# Altium schematic sheet 5V-REG.SchDoc
size A; SheetNumber: 1; SheetTotal: 1
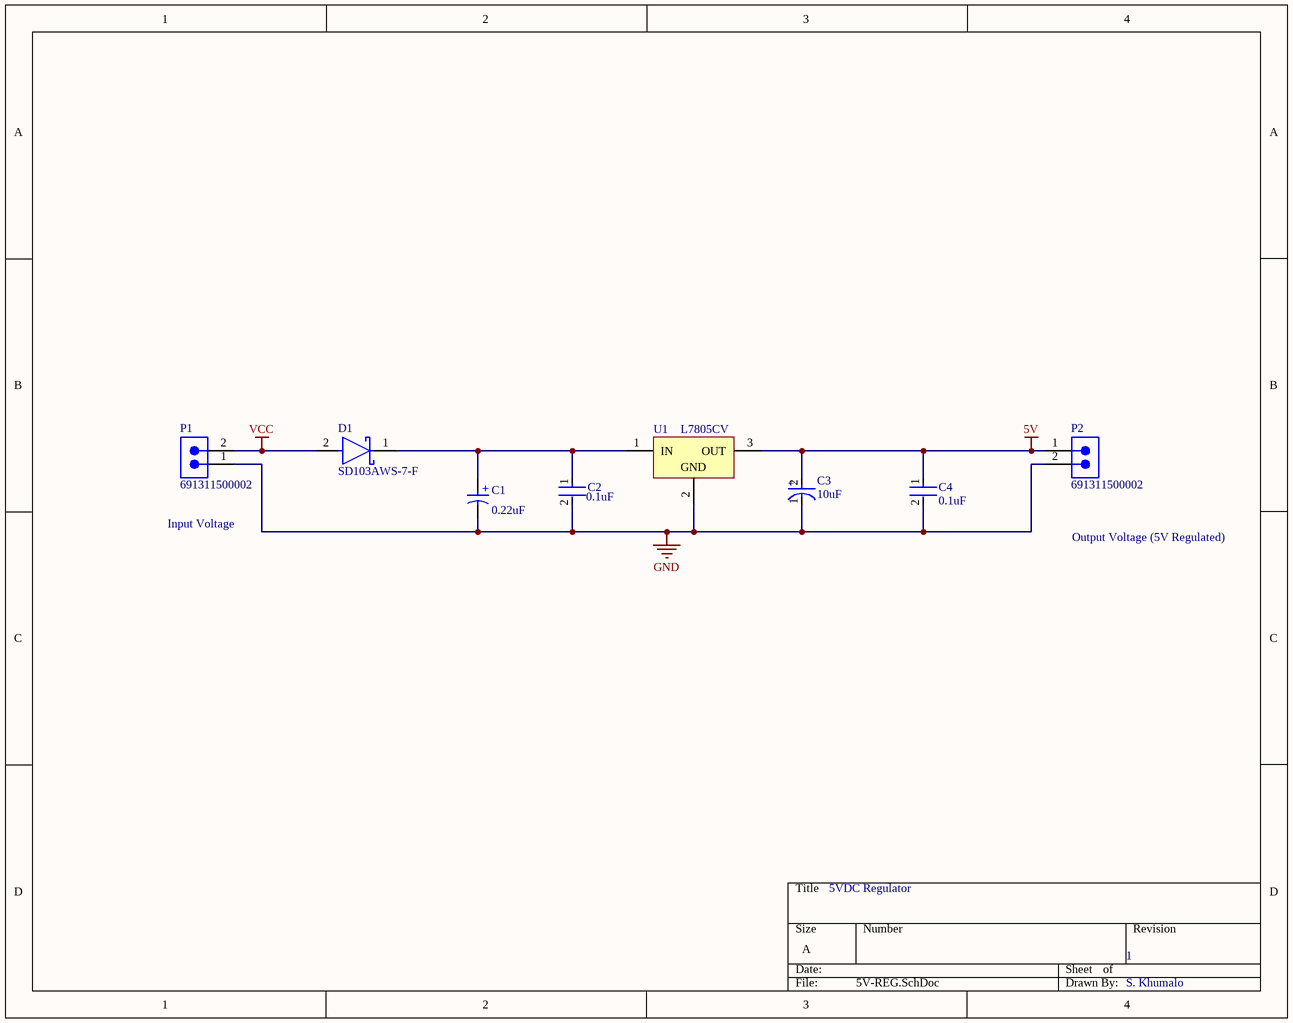
[diagram p0: 5V-REG.SchDoc]

## Parts
C1  0.22uF  [WCAP-ATG8_D5H11]
C2  0.1uF  [FP-RDE0P1-MFG]
C3  10uF  [FP-RAD-TH-D_5_0_5-L_11_1-MFG]
C4  0.1uF  [FP-RDE0P1-MFG]
D1  SD103AWS-7-F  [FP-SOD323-MFG]
P1  691311500002  [691311500002]
P2  691311500002  [691311500002]
U1  L7805CV  [TO220]

## Nets
5V: C3.2(A) C4.1 P2.1 U1.3(OUT)
GND: C1.2(N) C2.2 C3.1(C) C4.2 P1.1 P2.2 U1.2(GND)
VCC: D1.2(A) P1.2
NetC1_1: C1.1(P) C2.1 D1.1(C) U1.1(IN)

## Notes on the sheet
- Input Voltage
- Output Voltage (5V Regulated)
- 5VDC Regulator
- 1
- S. Khumalo
- (in symbol CMP-03913-54007281-1) +
- (in symbol CMP-05427-001295-1) +

## Library data of the parts
C1 = CMP-03913-54007281-1: 860010772002 WCAP-ATG8 Aluminum Electrolytic Capacitors; Polarity: Polar; Voltage Rating: 63V; Dissipation Factor: 9%; Tolerance: 20%; Capacitance: 220nF; Leakage Current: 3µA; Pitch: 2mm; Life (Hours): 2000hours; Ripple Current: 4mA; Diameter: 5mm; NexarPartId: 54007281; RoHS: Compliant; Lead Pitch: 2.0066mm; Min Operating Temperature: -40°C; Max Operating Temperature: 85°C; Case/Package: Radial; Height - Seated (Max): 12.4968mm; Mount: Through Hole; Height: 11mm; REACH SVHC: Unknown; Voltage Rating (DC): 63V; Length: 11mm; Packaging: Tape & Box (TB)
C2 C4 = CMP-06035-036375-1: Ceramic Capacitor 100nF ±10% 25V X7R Radial; Lead Diameter: 0.5mm; Mount: Through Hole; Resistor Type: Ceramic; Case/Package: Radial; Height - Seated (Max): 0.236inch; Lead Pitch: 0.098inch; Lead Free: Lead Free; Voltage Rating (DC): 25V; Width: 0.098inch; Packaging: Bulk; Dielectric: X7R; Tolerance: 10%; Min Operating Temperature: -55°C; Capacitance: 100nF; Max Operating Temperature: 125°C; Termination: Radial; Height: 3.5mm; Package Quantity: 500; Voltage Rating: 25V; Length: 0.197inch
C3 = CMP-05427-001295-1: Aluminum Electrolytic Capacitors (Radial Lead Type) 10uF ±20% 50V; Lead Diameter: 0.5mm; Life (Hours): 5000Hour; Impedance: 340mR; Ripple Current (AC): 250mA; REACH SVHC: Yes; Tolerance: 20%; Construction: RADIAL; Min Operating Temperature: -40°C; Termination: Radial; Voltage Rating: 50V; Height: 11mm; Max Operating Temperature: 105°C; Capacitance: 10uF; Voltage: 50V; Diameter: 5mm; Lead Pitch: 2mm; Series: FR Radial; RoHS Compliant: Yes; Case/Package: Radial
D1 = CMP-12790-000048-1: DIODE SCHOTTKY 40V 350MA SOD323; Manufacturer: Diodes Inc.; Max Surge Forward Current: 1.5A; Capacitance: 35pF; Peak Reverse Current: 5uA; Standoff Height: 0.05mm; Max Junction Temp: +125°C; Value: 35pF; Automotive Grade: Grade 1; Description: Diode Schottky 40V 350mA (DC) Surface Mount SOD-323; ComponentLink2URL: https://www.diodes.com/assets/Datasheets/ds30101.pdf; Ipc Land Pattern Name: SOD250130X110-2; Octopart: https://octopart.com/sd103aws-7-f-diodes+inc.-55389602; Forward Current: 350mA; Device Class L1: Discrete Semiconductors; Lead Free: Yes; ComponentLink2Description: Datasheet; RoHS: TRUE; Temperature: -65°C to +125°C; Temperature Range Low: -65°C; Category: Diode; Package: SOD323; Digikey Description: DIODE SCHOTTKY 40V 350MA SOD323; Automotive: Yes; Device Class L2: Diodes; Mouser Description: Schottky Diodes & Rectifiers 40V 200mW; Manufacturer Part Number: SD103AWS-7-F; Device Class L3: Schottky Diodes; Max Repetitive Reverse Voltage: 40V; Footprint Url: https://www.diodes.com/assets/Package-Files/SOD323.pdf; Reverse Voltage: 40V; Temperature Range High: +125°C; Height: 1.2mm
P1 P2 = CMP-1502-02123-2: NexarPartId: 8917741; Current: 20A; Number of Contacts: 2; Number of Levels: 1; Gender: Male; Pitch: 5.08mm; Voltage: 300V; Length: 8.5mm; Number of Pins: 2; Termination: Solder; Color: Green; Number of Rows: 1; Contact Plating: Tin; Number of Positions Per Level: 2; Orientation: Vertical; REACH SVHC: Unknown; Packaging: Box; Height: 12mm; Contact Material: Brass; Mount: Through Hole; Width: 10.16mm; RoHS: Compliant; Lead Pitch: 5.08mm
U1 = CMP-0244-00483-1: Positive Voltage Regulator, 5V, 3-Pin TO-220; PackageDescription: TO, Thru-Hole, Vertical, Heatsink Mounted; 3 In-Line Leads; Pitch 2.54 mm; ComponentLink2Description: Datasheet; PackageReference: TO220; ComponentLink3URL: http://www.st.com/internet/com/TECHNICAL_RESOURCES/TECHNICAL_LITERATURE/PACKAGE_INFORMATION/CD00004649.pdf; DatasheetVersion: 16/11/2011; ComponentLink1Description: Manufacturer URL; ComponentLink1URL: http://www.st.com; PackageVersion: ver3.0; ComponentLink3Description: Package Specification; ComponentLink2URL: http://www.st.com/internet/com/TECHNICAL_RESOURCES/TECHNICAL_LITERATURE/DATASHEET/CD00000444.pdf